# Altium project br17_doublesided.PrjPcb
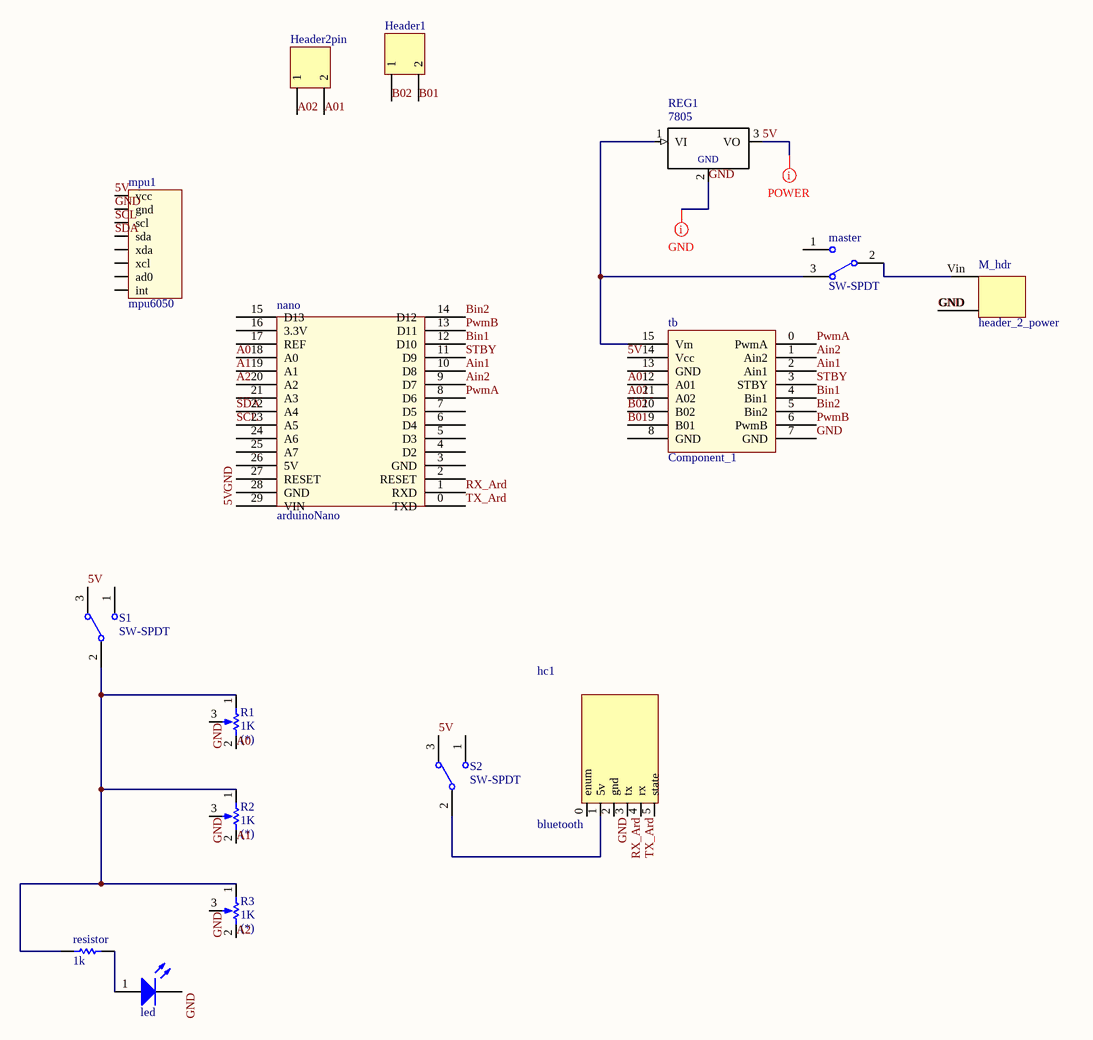
[diagram p0: br17.SchDoc]
1 sheet, 16 parts. Net scope: global (net labels, ports and power ports of the same name join across sheets).
Board file: br17.PcbDoc

## Sheet br17.SchDoc
size A3

### Parts
hc1  bluetooth  [hc05]
Header1  Header 2  [HDR2_pin]  (value not drawn)
Header2pin  Header 2  [HDR2_pin]  (value not drawn)
led  L_green  [Led_green]  (value not drawn)
M_hdr  header_2_power  [HDR2_POWER]
master  SW-SPDT  [SPDT]
mpu1  mpu6050  [mpu6050]
nano  arduinoNano  [Arduino nano]
R1  value 1K  TYPE: (*)  [pot_alpha]  (hidden comment: ALPHA Potentiometer)
R2  value 1K  TYPE: (*)  [pot_alpha]  (hidden comment: ALPHA Potentiometer)
R3  value 1K  TYPE: (*)  [pot_alpha]  (hidden comment: ALPHA Potentiometer)
REG1  7805  [TO92-]
resistor  value 1k  [led]  (hidden comment: resistance)
S1  SW-SPDT  [SPDT]
S2  SW-SPDT  [SPDT]
tb  Component_1  [tb6612]

### Nets
5V: mpu1.0(vcc) nano.29(VIN) REG1.3(VO) S1.3 S2.3 tb.14(Vcc)
A0: nano.18(A0) R1.2(BOT)
A1: nano.19(A1) R2.2(BOT)
A01: Header2pin.2 tb.12(A01)
A2: nano.20(A2) R3.2(BOT)
A02: Header2pin.1 tb.11(A02)
Ain1: nano.10(D8) tb.2(Ain1)
Ain2: nano.9(D7) tb.1(Ain2)
B01: Header1.2 tb.9(B01)
B02: Header1.1 tb.10(B02)
Bin1: nano.12(D10) tb.4(Bin1)
Bin2: nano.14(D12) tb.5(Bin2)
GND: hc1.2(gnd) led.2(K) M_hdr.GND mpu1.1(gnd) nano.28(GND) R1.3(TAP) R2.3(TAP) R3.3(TAP) REG1.2(GND) tb.7(GND)
PwmA: nano.8(D6) tb.0(PwmA)
PwmB: nano.13(D11) tb.6(PwmB)
RX_Ard: hc1.3(tx) nano.1(RXD)
SCL: mpu1.2(scl) nano.23(A5)
SDA: mpu1.3(sda) nano.22(A4)
STBY: nano.11(D9) tb.3(STBY)
TX_Ard: hc1.4(rx) nano.0(TXD)
Nethc1_1: hc1.1(5v) S2.2
Netled_1: led.1(V) resistor.2
NetM_hdr_Vin: M_hdr.Vin master.2
Netmaster_3: master.3 REG1.1(VI) tb.15(Vm)
NetR1_1: R1.1(TOP) R2.1(TOP) R3.1(TOP) resistor.1 S1.2

Not connected (* = marked no-connect by the designer): hc1 0(enum) 5(state); master 1; mpu1 4(xda) 5(xcl) 6(ad0) 7(int); nano 2(RESET) 3(GND) 4(D2) 5(D3) 6(D4) 7(D5) 15(D13) 16(3.3V) 17(REF) 21(A3) 24(A6) 25(A7) 26(5V) 27(RESET); S1 1; S2 1; tb 8(GND) 13(GND)

### Layout directives
net class Undefined; rule Routing Layers [TopLayer - DisabledBottomLayer - Disabled]; rule Width Constraint [Pref Width = 10mil    Min Width = 10mil    Max Width = 10mil]: GND
rule Width Constraint [Pref Width = 23.622mil    Min Width = 10mil    Max Width = 23.622mil]; rule Routing Layers [TopLayer - DisabledBottomLayer - Enabled ]: 5V

### Library data of the parts
hc1 = hc05: bluetooth device hc 05
Header1 Header2pin = Header 2: Header, 2-Pin; LatestRevisionDate: 17-Jul-2002; LatestRevisionNote: Re-released for DXP Platform.; Publisher: Altium Limited
master S1 S2 = SW-SPDT: SPDT Subminiature Toggle Switch, Right Angle Mounting, Vertical Actuation; Published: 24-Mar-1999; LatestRevisionDate: 17-Dec-2003; LatestRevisionNote: Schematic revised, PCB Footprint replaced.; DatasheetVersion: 05-Dec-2000; PackageReference: TL36WW15050; Publisher: Altium Limited; PackageDescription: Switch; 4 Leads; ComponentLink1Description: Manufacturer Link; ComponentLink1URL: http://www.apem.com
mpu1 = mpu6050: this is mpu6050; Supplier 1: Digi-Key; Supplier Part Number 1: 1428-1007-2-ND
R1-R3 = alpha-pot: Potentiometer; Sim Note: Enter the Resistance value and the set point into parameter fields.; Set Position: 0.5; Published: 8-Jun-2000; LatestRevisionDate: 17-Jul-2002; LatestRevisionNote: Re-released for DXP Platform.; PackageReference: VR5; Publisher: Altium Limited; PackageDescription: Variable Resistor, Thru-Hole; 3 Leads
REG1 = 7805: Conn Quick Fit Header HDR 5 POS 5.1mm Solder RA Thru-Hole; MF: Keystone; SnapEDA_Link: https://www.snapeda.com/parts/7805/Keystone%20Electronics/view-part/?ref=snap; Price: 2.12 USD; MP: 7805; Package: None; Availability: Bad; Value: *